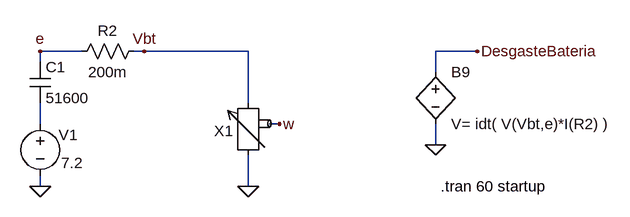
[diagram p0: schematic DiretoBateria.asc]
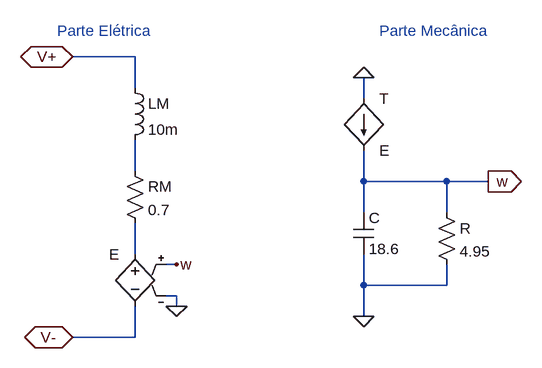
[diagram p1: sub-circuit carga_motor.asc]
DiretoBateria.asc, the LTspice schematic file:
Version 4
SHEET 1 2244 924
WIRE 160 -32 96 -32
WIRE 256 -32 240 -32
WIRE 416 -32 256 -32
WIRE 768 -32 704 -32
WIRE 96 -16 96 -32
WIRE 704 0 704 -32
WIRE 416 48 416 -32
WIRE 96 80 96 48
WIRE 464 80 448 80
WIRE 704 112 704 80
WIRE 96 176 96 160
WIRE 416 176 416 128
FLAG 96 176 0
FLAG 416 176 0
FLAG 256 -32 Vbt
FLAG 704 112 0
FLAG 768 -32 DesgasteBateria
FLAG 464 80 w
FLAG 96 -32 e
SYMBOL voltage 96 64 R0
WINDOW 3 32 76 Left 2
WINDOW 123 0 0 Left 2
WINDOW 39 0 0 Left 0
WINDOW 0 28 33 Left 2
SYMATTR Value 7.2
SYMATTR InstName V1
SYMBOL carga_motor 384 48 R0
SYMATTR InstName X1
SYMBOL res 256 -48 R90
WINDOW 0 0 56 VBottom 2
WINDOW 3 32 56 VTop 2
SYMATTR InstName R2
SYMATTR Value 200m
SYMBOL bv 704 -16 R0
SYMATTR InstName B9
SYMATTR Value V= idt( V(Vbt,e)*I(R2) )
SYMBOL cap 80 -16 R0
SYMATTR InstName C1
SYMATTR Value 51600
TEXT 712 176 Left 2 !.tran 60 startup

carga_motor.asc, the sub-circuit schematic file:
Version 4
SHEET 1 880 680
WIRE -16 -64 -112 -64
WIRE -16 -16 -16 -64
WIRE 336 0 336 -32
WIRE -16 112 -16 64
WIRE 336 128 336 80
WIRE 464 128 336 128
WIRE 528 128 464 128
WIRE 336 176 336 128
WIRE 464 176 464 128
WIRE -16 240 -16 192
WIRE 48 256 32 256
WIRE 336 288 336 240
WIRE 464 288 464 256
WIRE 464 288 336 288
WIRE 48 304 32 304
WIRE 48 320 48 304
WIRE 336 336 336 288
WIRE -16 368 -16 320
WIRE -16 368 -112 368
FLAG 336 -32 0
FLAG -112 -64 V+
IOPIN -112 -64 BiDir
FLAG -112 368 V-
IOPIN -112 368 BiDir
FLAG 48 320 0
FLAG 336 336 0
FLAG 528 128 w
IOPIN 528 128 Out
FLAG 48 256 w
SYMBOL ind -32 -32 R0
SYMATTR InstName LM
SYMATTR Value 10m
SYMBOL res -32 96 R0
SYMATTR InstName RM
SYMATTR Value 0.7
SYMBOL e -16 224 M0
SYMATTR InstName E
SYMATTR Value ""
SYMATTR Value2 1
SYMBOL cap 320 176 R0
SYMATTR InstName C
SYMATTR Value 18.6
SYMBOL res 448 160 R0
SYMATTR InstName R
SYMATTR Value 4.95
SYMBOL f 336 0 R0
SYMATTR InstName T
SYMATTR Value E
SYMATTR Value2 1
TEXT 360 -104 Left 2 ;Parte Mecânica
TEXT -136 -104 Left 2 ;Parte Elétrica

The netlist it stands for:
* DiretoBateria.asc
V1 N001 0 7.2
XX1 Vbt 0 w carga_motor
R2 Vbt e 200m
B9 DesgasteBateria 0 V= idt( V(Vbt,e)*I(R2) )
C1 e N001 51600

* block symbol definitions
.subckt carga_motor V+ V- w
LM V+ N001 10m
RM N001 N002 0.7
E N002 V- w 0 1
C w 0 18.6
R w 0 4.95
F§T 0 w E 1
* Parte Mecânica
* Parte Elétrica
.ends carga_motor

.tran 60 startup
.backanno
.end